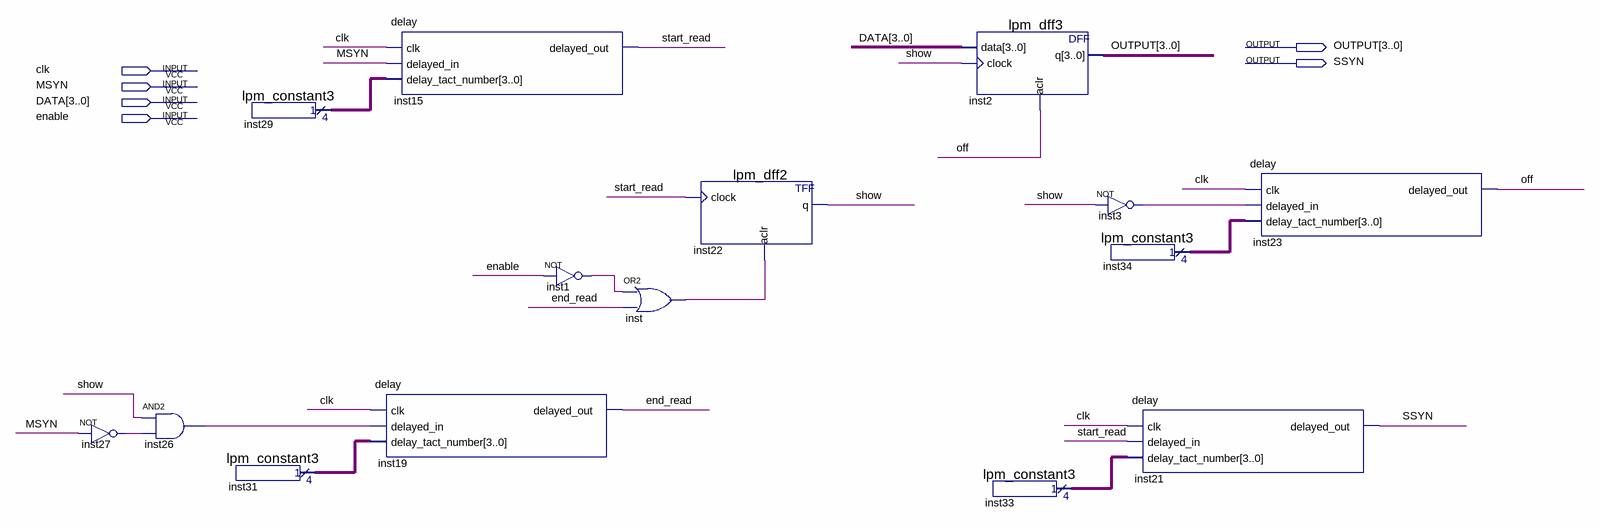
[diagram p0: schematic sheet]
// Quartus schematic slave.bdf as structural Verilog: 15 symbols, 6 pins
module slave (
  input  clk,
  input  MSYN,
  input  [3:0] DATA,
  input  enable,
  output [3:0] OUTPUT,
  output SSYN
);

  wire end_read, inst1_out, inst3_out, inst26_out, inst27_out, inst_out, off, show, start_read;
  wire [3:0] inst29_result, inst31_result, inst33_result, inst34_result;

  not inst27 (inst27_out, MSYN);
  and inst26 (inst26_out, show, inst27_out);
  lpm_constant3 inst29 (.result(inst29_result));
  lpm_constant3 inst31 (.result(inst31_result));
  delay inst15 (.clk(clk), .delayed_in(MSYN), .delay_tact_number(inst29_result), .delayed_out(start_read));
  delay inst19 (.clk(clk), .delayed_in(inst26_out), .delay_tact_number(inst31_result), .delayed_out(end_read));
  not inst1 (inst1_out, enable);
  or inst (inst_out, inst1_out, end_read);
  lpm_dff2 inst22 (.clock(start_read), .aclr(inst_out), .q(show));
  lpm_dff3 inst2 (.data(DATA), .clock(show), .aclr(off), .q(OUTPUT));
  lpm_constant3 inst33 (.result(inst33_result));
  not inst3 (inst3_out, show);
  lpm_constant3 inst34 (.result(inst34_result));
  delay inst21 (.clk(clk), .delayed_in(start_read), .delay_tact_number(inst33_result), .delayed_out(SSYN));
  delay inst23 (.clk(clk), .delayed_in(inst3_out), .delay_tact_number(inst34_result), .delayed_out(off));
endmodule
